# EAGLE design shield (EAGLE 7.5.0)
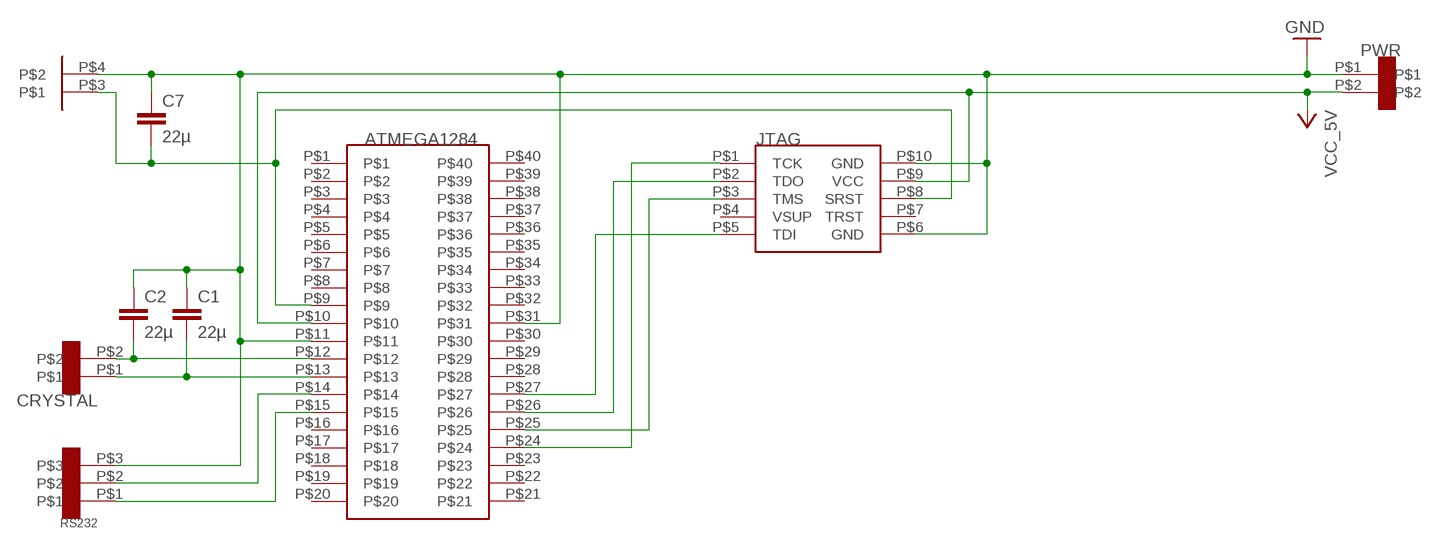
[diagram p0: schematic, sheet 1]

## Parts
ATMEGA1284  CON_DIL_2X20  [CON_DIL_2X20]
C1  22µ  C-EU025-030X050  [C025-030X050]
C2  22µ  C-EU025-030X050  [C025-030X050]
C7  22µ  C-EU025-030X050  [C025-030X050]
CRYSTAL  CON_DIL_2  [CON_DIL_2]
JTAG  JTAG  [CON_DIL_2X5]
PWR  CON_DIL_2  [CON_DIL_2]
RS232  CON_DIL_3  [CON_DIL_3]
RST  RST  [RST]

## Nets
GND: ATMEGA1284.P$11 ATMEGA1284.P$31 C1.1 C2.1 C7.1 JTAG.P$6(GND) JTAG.P$10(GND) PWR.P$1 RS232.P$3 RST.P$4
N$1: ATMEGA1284.P$24 JTAG.P$1(TCK)
N$2: ATMEGA1284.P$25 JTAG.P$3(TMS)
N$3: ATMEGA1284.P$26 JTAG.P$2(TDO)
N$4: ATMEGA1284.P$27 JTAG.P$5(TDI)
N$5: ATMEGA1284.P$14 RS232.P$2
N$6: ATMEGA1284.P$15 RS232.P$1
N$7: ATMEGA1284.P$12 C2.2 CRYSTAL.P$2
N$8: ATMEGA1284.P$13 C1.2 CRYSTAL.P$1
RST: ATMEGA1284.P$9 C7.2 JTAG.P$8(SRST) RST.P$3
VCC: ATMEGA1284.P$10 JTAG.P$9(VCC) PWR.P$2 ; supply symbol labelled VCC_5V
Unconnected: ATMEGA1284.P$1 ATMEGA1284.P$2 ATMEGA1284.P$3 ATMEGA1284.P$4 ATMEGA1284.P$5 ATMEGA1284.P$6 ATMEGA1284.P$7 ATMEGA1284.P$8 ATMEGA1284.P$16 ATMEGA1284.P$17 ATMEGA1284.P$18 ATMEGA1284.P$19 ATMEGA1284.P$20 ATMEGA1284.P$21 ATMEGA1284.P$22 ATMEGA1284.P$23 ATMEGA1284.P$28 ATMEGA1284.P$29 ATMEGA1284.P$30 ATMEGA1284.P$32 ATMEGA1284.P$33 ATMEGA1284.P$34 ATMEGA1284.P$35 ATMEGA1284.P$36 ATMEGA1284.P$37 ATMEGA1284.P$38 ATMEGA1284.P$39 ATMEGA1284.P$40 JTAG.P$4(VSUP) JTAG.P$7(TRST)

## Library data of the parts
ATMEGA1284 = connector:CON_DIL_2X20
C1 C2 C7 = rcl:C-EU: CAPACITOR, European symbol
CRYSTAL PWR = connector:CON_DIL_2
JTAG = connector:JTAG
RS232 = connector:CON_DIL_3
RST = rst_button:RST

## Board
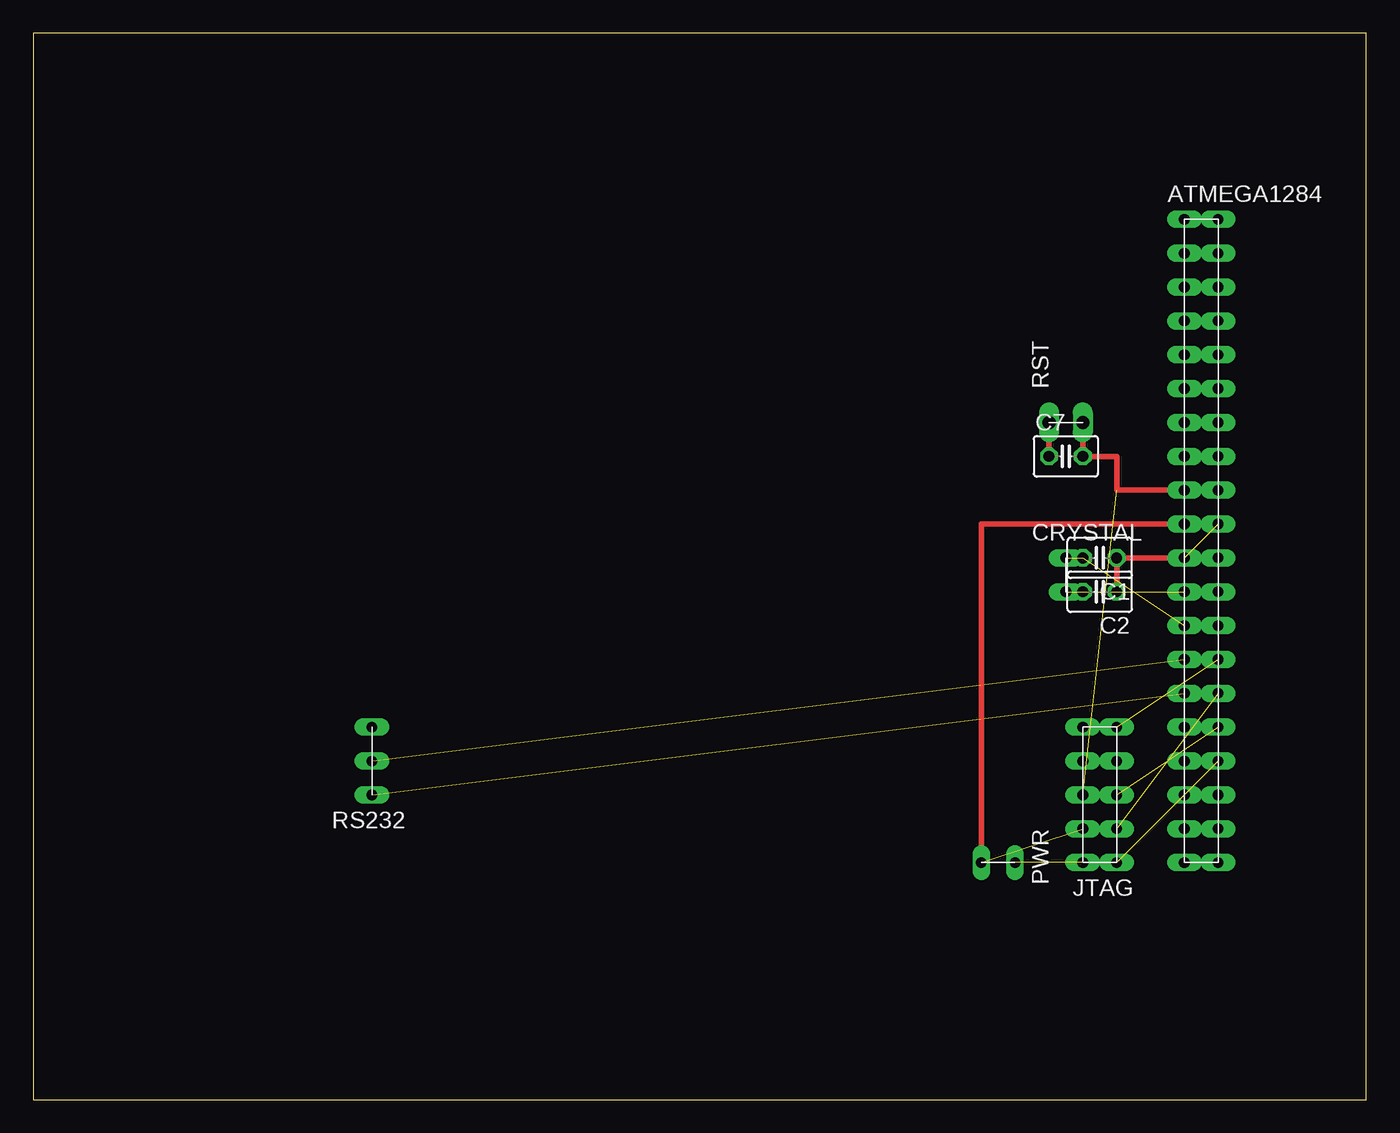
[diagram p1: board, top side]
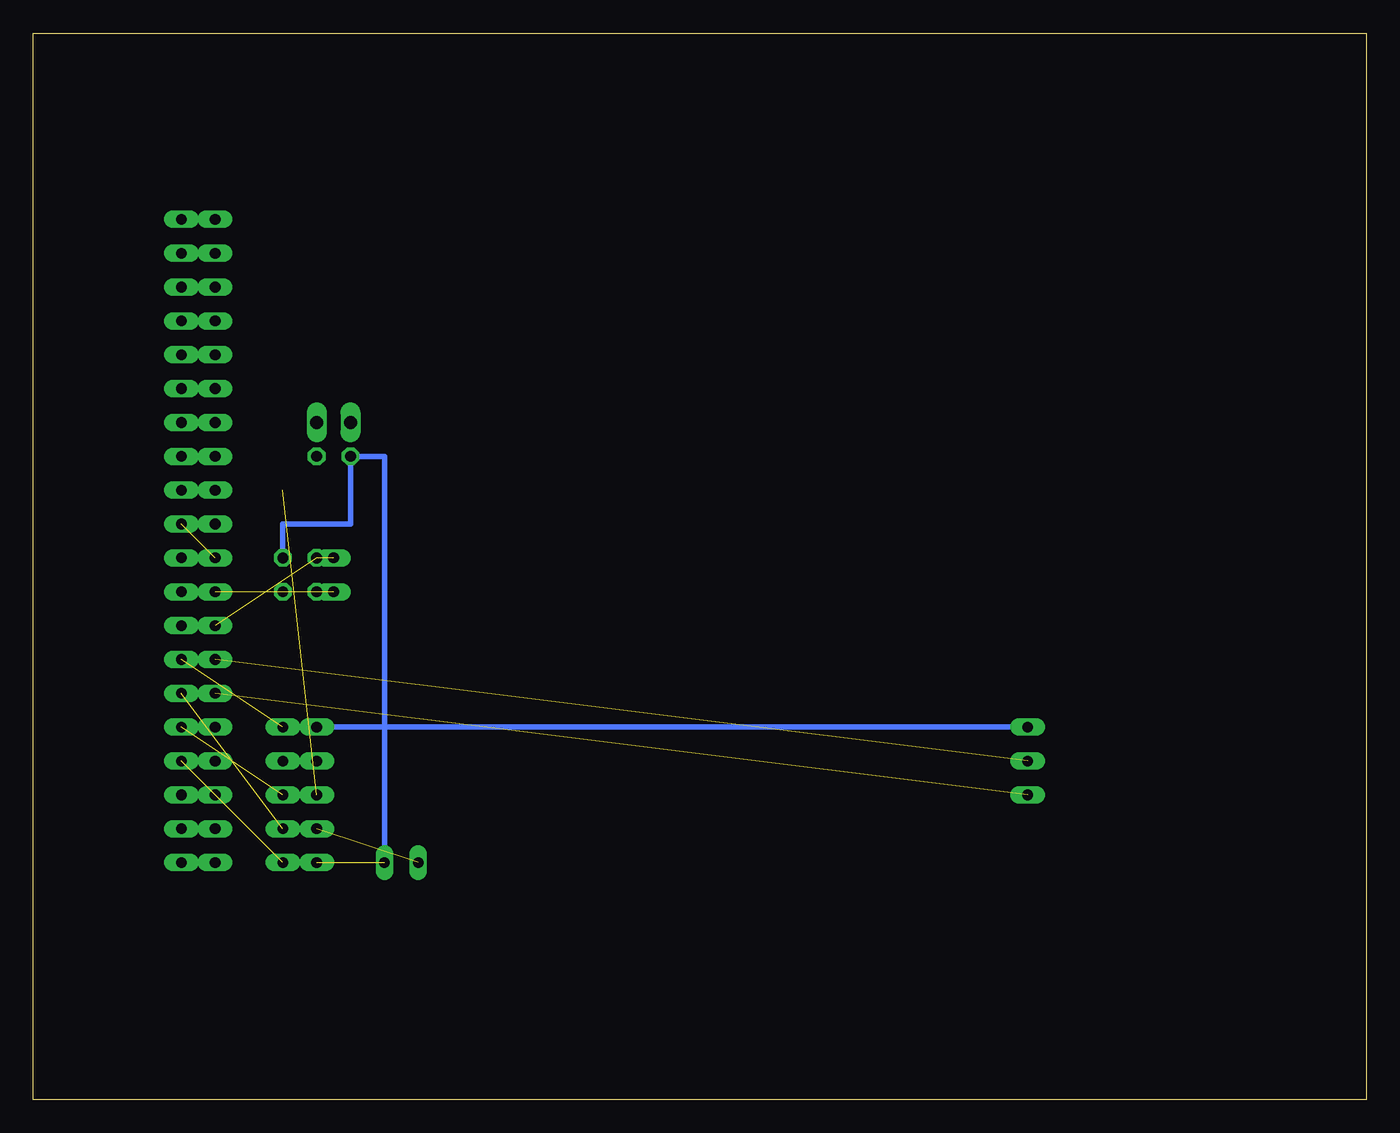
[diagram p2: board, bottom side, seen from below]

Size 100 x 80 mm. Coordinates in mm from the lower left corner, seen from the top.
Outline: 0,0 100,0 100,80 0,80 0,0
Copper layers (1*16): Top 0.035mm / dielectric 1.5mm / Bottom 0.035mm
Design rules "default": minimum track width 10mil, minimum drill 24mil, track to track 8mil, track to pad 8mil, pad to pad 8mil, via to via 8mil, smd to smd 8mil, copper to edge 40mil, drill to drill 8mil, minimum pad ring 10mil, minimum via ring 8mil, stop-mask expansion 4mil, vias tented up to drill 0mil, thermal gap 10mil

### Footprints (pad centres in the part's own frame; a part is rotated, then mirrored left to right if it is on the bottom)
CON_DIL_2X20 = drill 0.8 long: P$1 -1.27,24.13; P$2 -1.27,21.59; P$3 -1.27,19.05; P$4 -1.27,16.51; P$5 -1.27,13.97; P$6 -1.27,11.43; P$7 -1.27,8.89; P$8 -1.27,6.35; P$9 -1.27,3.81; P$10 -1.27,1.27; P$11 -1.27,-1.27; P$12 -1.27,-3.81; P$13 -1.27,-6.35; P$14 -1.27,-8.89; P$15 -1.27,-11.43; P$16 -1.27,-13.97; P$17 -1.27,-16.51; P$18 -1.27,-19.05; P$19 -1.27,-21.59; P$20 -1.27,-24.13; P$21 1.27,-24.13; P$22 1.27,-21.59; P$23 1.27,-19.05; P$24 1.27,-16.51; P$25 1.27,-13.97; P$26 1.27,-11.43; P$27 1.27,-8.89; P$28 1.27,-6.35; P$29 1.27,-3.81; P$30 1.27,-1.27; P$31 1.27,1.27; P$32 1.27,3.81; P$33 1.27,6.35; P$34 1.27,8.89; P$35 1.27,11.43; P$36 1.27,13.97; P$37 1.27,16.51; P$38 1.27,19.05; P$39 1.27,21.59; P$40 1.27,24.13
C025-030X050 = drill 0.813 octagon: 1 -1.27,0; 2 1.27,0
CON_DIL_2 = drill 0.8 long: P$1 0,2.54; P$2 0,0
CON_DIL_2X5 = drill 0.8 long: P$1 -1.27,5.08; P$2 -1.27,2.54; P$3 -1.27,0; P$4 -1.27,-2.54; P$5 -1.27,-5.08; P$6 1.27,-5.08; P$7 1.27,-2.54; P$8 1.27,0; P$9 1.27,2.54; P$10 1.27,5.08
CON_DIL_3 = drill 0.8 long: P$1 0,2.54; P$2 0,0; P$3 0,-2.54
RST = drill 1 long: P$3 0,0; P$4 0,2.54

### Placement (x,y rotation side)
ATMEGA1284  87.63,41.91 0 top
C1  80.01,40.64 180 top
C2  80.01,38.1 180 top
C7  77.47,48.26 0 top
CRYSTAL  77.47,38.1 0 top
JTAG  80.01,22.86 180 top
PWR  71.12,17.78 270 top
RS232  25.4,25.4 180 top
RST  78.74,50.8 90 top

### Tracks (layer width: path | path; a pad name or v marks a point on that pad's centre or on a via)
GND  (2 unrouted)
  Top 0.406: RST.P$4 C7.1 | ATMEGA1284.P$11 C1.1 C2.1
  Bottom 0.406: PWR.P$1 73.66,27.94 | JTAG.P$6 73.66,27.94 | 73.66,27.94 RS232.P$3 | 73.66,27.94 73.66,48.26 C7.1 76.2,43.18 81.28,43.18 C1.1
N$1  (1 unrouted)
N$2  (1 unrouted)
N$3  (1 unrouted)
N$4  (1 unrouted)
N$5  (1 unrouted)
N$6  (1 unrouted)
N$7  (2 unrouted)
N$8  (2 unrouted)
RST  (1 unrouted)
  Top 0.406: RST.P$3 C7.2 81.28,48.26 81.28,45.72 ATMEGA1284.P$9
VCC  (1 unrouted)
  Top 0.406: PWR.P$2 71.12,43.18 ATMEGA1284.P$10